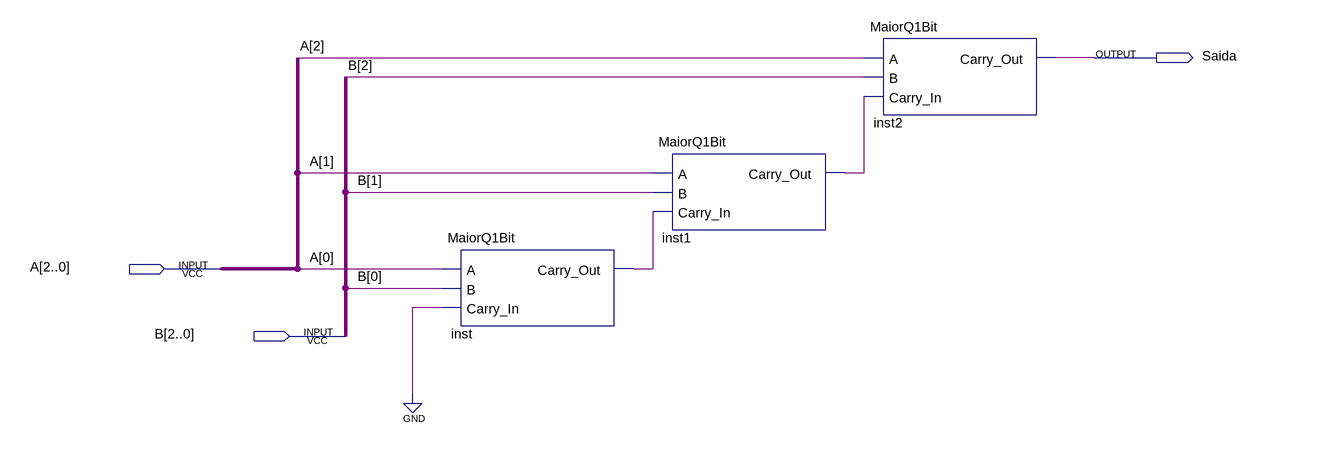
[diagram p0: schematic sheet]
// Quartus schematic MaiorQ3Bit.bdf as structural Verilog: 3 symbols, 3 pins
module MaiorQ3Bit (
  input  [2:0] A,
  input  [2:0] B,
  output Saida
);

  wire inst1_carry_out, inst_carry_out;

  MaiorQ1Bit inst (.A(A[0]), .B(B[0]), .Carry_In(1'b0), .Carry_Out(inst_carry_out));
  MaiorQ1Bit inst1 (.A(A[1]), .B(B[1]), .Carry_In(inst_carry_out), .Carry_Out(inst1_carry_out));
  MaiorQ1Bit inst2 (.A(A[2]), .B(B[2]), .Carry_In(inst1_carry_out), .Carry_Out(Saida));
endmodule
